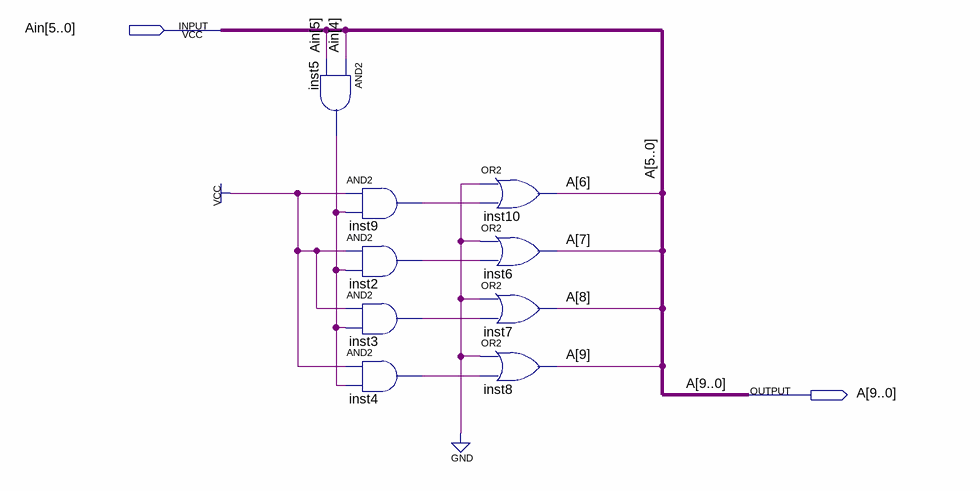
[diagram p0: schematic sheet]
// Quartus schematic extender6to10.bdf as structural Verilog: 9 symbols, 2 pins
module extender6to10 (
  input  [5:0] Ain,
  output [9:0] A
);

  wire inst2_out, inst3_out, inst4_out, inst5_out, inst9_out;

  and inst5 (inst5_out, Ain[4], Ain[5]);
  and inst9 (inst9_out, 1'b1, inst5_out);
  and inst2 (inst2_out, 1'b1, inst5_out);
  and inst3 (inst3_out, 1'b1, inst5_out);
  and inst4 (inst4_out, 1'b1, inst5_out);
  or inst10 (A[6], 1'b0, inst9_out);
  or inst6 (A[7], 1'b0, inst2_out);
  or inst7 (A[8], 1'b0, inst3_out);
  or inst8 (A[9], 1'b0, inst4_out);

  assign A[5:0] = Ain;
endmodule
